# Altium schematic sheet camera.SchDoc
size A4
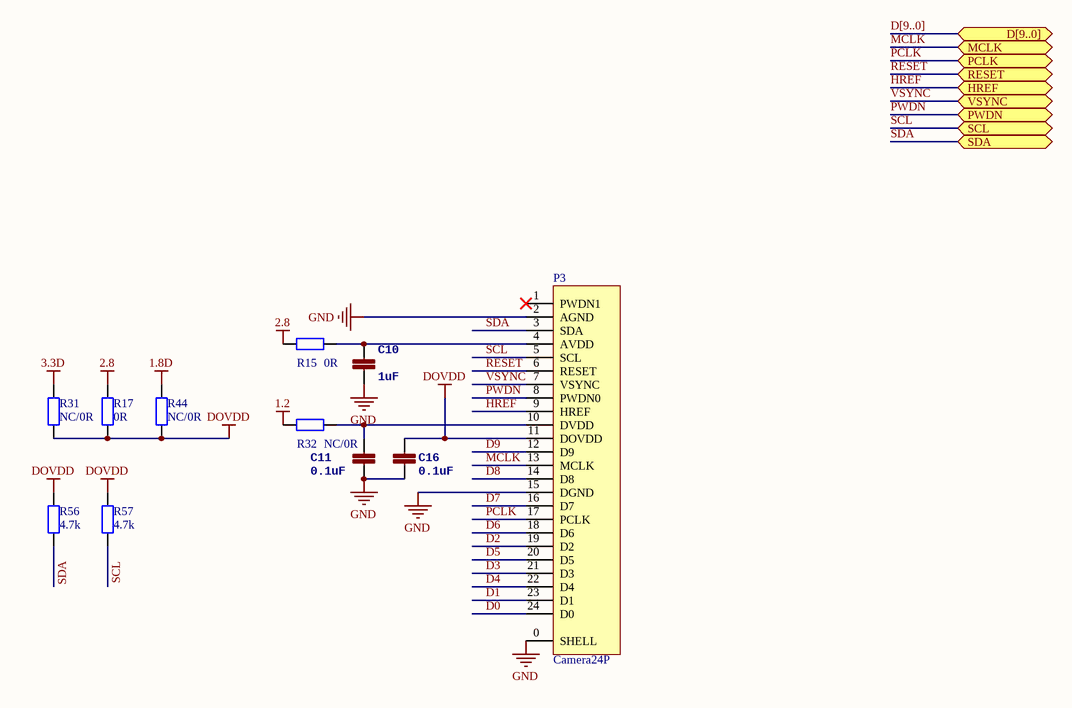
[diagram p0: camera.SchDoc]

## Parts
C10  1uF  [0402]
C11  0.1uF  [0402]
C16  0.1uF  [0402]
P3  Camera24P  [FPC-0.5mm-24]
R15  0R  [0402]
R17  0R  [0402]
R31  NC/0R  [0402]
R32  NC/0R  [0402]
R44  NC/0R  [0402]
R56  4.7k  [0402]
R57  4.7k  [0402]

## Ports
D[9..0], HREF, MCLK, PCLK, PWDN, RESET, SCL, SDA, VSYNC

## Nets
1.2: R32.2
1.8D: R44.1
2.8: R15.2 R17.1
3.3D: R31.1
DOVDD: C16.2 P3.11(DOVDD) R17.2 R31.2 R44.2 R56.1 R57.1
GND: C10.1 C11.1 C16.1 P3.0(SHELL) P3.2(AGND) P3.15(DGND)
D0: P3.24(D0)
D1: P3.23(D1)
D2: P3.19(D2)
D3: P3.21(D3)
D4: P3.22(D4)
D5: P3.20(D5)
D6: P3.18(D6)
D7: P3.16(D7)
D8: P3.14(D8)
D9: P3.12(D9)
HREF: P3.9(HREF) ; port HREF
MCLK: P3.13(MCLK) ; port MCLK
PCLK: P3.17(PCLK) ; port PCLK
PWDN: P3.8(PWDN0) ; port PWDN
RESET: P3.6(RESET) ; port RESET
SCL: P3.5(SCL) R57.2 ; port SCL
SDA: P3.3(SDA) R56.2 ; port SDA
VSYNC: P3.7(VSYNC) ; port VSYNC
NetC10_2: C10.2 P3.4(AVDD) R15.1
NetC11_2: C11.2 P3.10(DVDD) R32.1

Not connected (* = marked no-connect by the designer): P3 1(PWDN1)*

## Buses and harness runs
bus D[9..0] = port D[9..0]

## Library data of the parts
C10 C11 C16 = CAP0402-CAP: <b>Capacitor</b> / Standard 0603 ceramic capacitor, and 0.1" leaded capacitor.; PARTNO: CC0402ZRY5V7BB104
R15 R17 R31 R32 R44 R56 R57 = Res2: Resistor; Value: 0Ohm; Published: 8-Jun-2000; LatestRevisionDate: 17-Jul-2002; LatestRevisionNote: Re-released for DXP Platform.; PackageReference: AXIAL-0.4; Publisher: Altium Limited; PackageDescription: Axial Device, Thru-Hole; 2 Leads; 0.4 in Pin Spacing